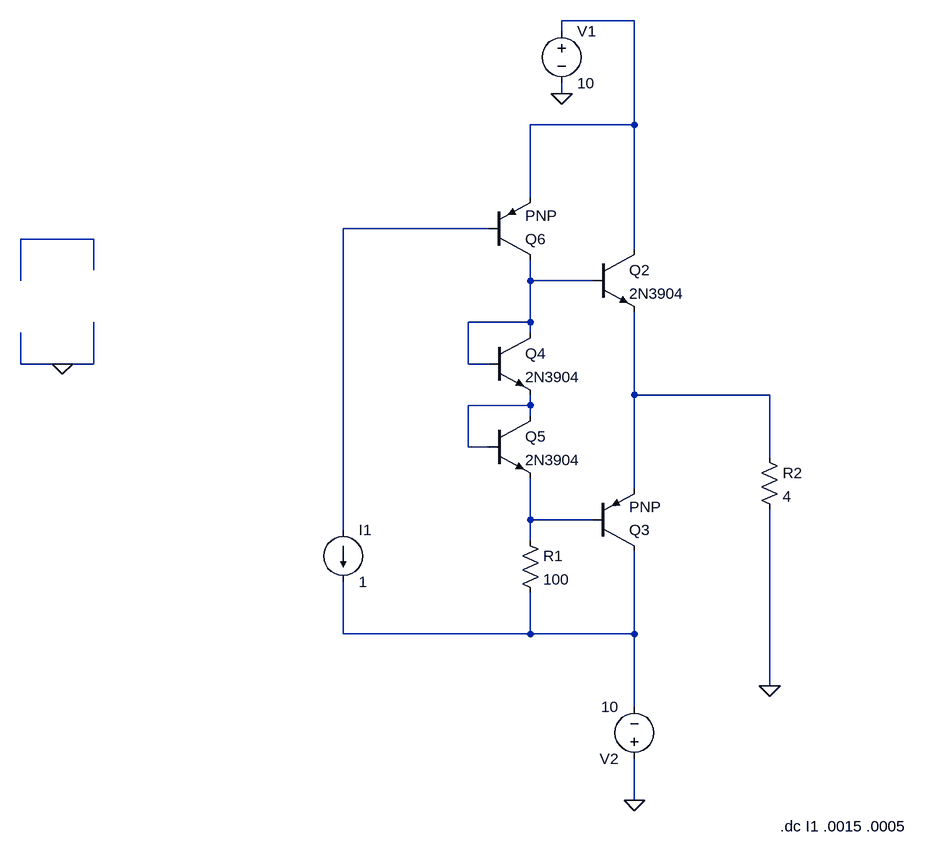
[diagram p0: schematic totem drive.asc]
totem drive.asc, the LTspice schematic file:
Version 4
SHEET 1 1272 864
WIRE 672 -512 560 -512
WIRE 560 -496 560 -512
WIRE 560 -400 560 -416
WIRE 672 -352 672 -512
WIRE 672 -352 512 -352
WIRE 512 -240 512 -352
WIRE 448 -192 224 -192
WIRE -160 -176 -272 -176
WIRE 672 -160 672 -352
WIRE -160 -128 -160 -176
WIRE -272 -112 -272 -176
WIRE 512 -112 512 -144
WIRE 608 -112 512 -112
WIRE 512 -48 512 -112
WIRE 512 -48 416 -48
WIRE 512 -32 512 -48
WIRE -272 16 -272 -32
WIRE -208 16 -272 16
WIRE -160 16 -160 -48
WIRE -160 16 -208 16
WIRE 416 16 416 -48
WIRE 448 16 416 16
WIRE 672 64 672 -64
WIRE 880 64 672 64
WIRE 512 80 512 64
WIRE 512 80 416 80
WIRE 512 96 512 80
WIRE 416 144 416 80
WIRE 448 144 416 144
WIRE 880 160 880 64
WIRE 672 208 672 64
WIRE 512 256 512 192
WIRE 608 256 512 256
WIRE 224 272 224 -192
WIRE 512 288 512 256
WIRE 224 432 224 352
WIRE 512 432 512 368
WIRE 512 432 224 432
WIRE 672 432 672 304
WIRE 672 432 512 432
WIRE 880 512 880 240
WIRE 672 544 672 432
WIRE 672 688 672 624
FLAG 560 -400 0
FLAG 672 688 0
FLAG 880 512 0
FLAG -208 16 0
SYMBOL voltage 560 -512 R0
WINDOW 123 0 0 Left 2
WINDOW 39 0 0 Left 2
SYMATTR InstName V1
SYMATTR Value 10
SYMBOL res 496 272 R0
SYMATTR InstName R1
SYMATTR Value 100
SYMBOL npn 608 -160 R0
SYMATTR InstName Q2
SYMATTR Value 2N3904
SYMBOL res 864 144 R0
SYMATTR InstName R2
SYMATTR Value 4
SYMBOL pnp 608 304 M180
SYMATTR InstName Q3
SYMBOL npn 448 -32 R0
SYMATTR InstName Q4
SYMATTR Value 2N3904
SYMBOL npn 448 96 R0
SYMATTR InstName Q5
SYMATTR Value 2N3904
SYMBOL pnp 448 -144 M180
SYMATTR InstName Q6
SYMBOL voltage 672 640 R180
WINDOW 123 0 0 Left 2
WINDOW 39 0 0 Left 2
SYMATTR InstName V2
SYMATTR Value 10
SYMBOL current 224 272 R0
WINDOW 123 0 0 Left 2
WINDOW 39 0 0 Left 2
SYMATTR InstName I1
SYMATTR Value 1
TEXT 896 728 Left 2 !.dc I1 .0015 .0005

The netlist it stands for:
* totem drive.asc
V1 N001 0 10
R1 N007 N008 100
Q2 N001 N004 N005 0 2N3904
R2 N005 0 4
Q3 N008 N007 N005 0 PNP
Q4 N004 N004 N006 0 2N3904
Q5 N006 N006 N007 0 2N3904
Q6 N004 N002 N001 0 PNP
V2 0 N008 10
I1 N002 N008 1
.model NPN NPN
.model PNP PNP
.lib standard.bjt
.dc I1 .0015 .0005
.backanno
.end